# EAGLE schematic Main circuit (EAGLE 6.6.0)
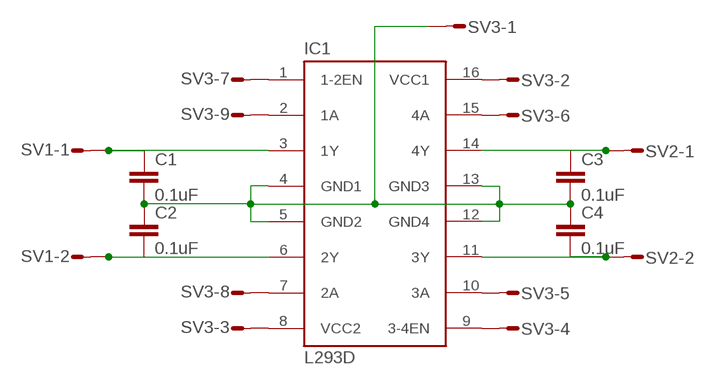
[diagram p0: schematic, sheet 1]

## Parts
C1  0.1uF  C2.5/2  [C2.5-2]
C2  0.1uF  C2.5/2  [C2.5-2]
C3  0.1uF  C2.5/2  [C2.5-2]
C4  0.1uF  C2.5/2  [C2.5-2]
IC1  L293D  [DIL16]
SV1  L02P  [L02P]
SV2  L02P  [L02P]
SV3  L09P  [L09P]

## Nets
N$1: C1.2 C2.1 C3.2 C4.1 IC1.4(GND1) IC1.5(GND2) IC1.12(GND4) IC1.13(GND3) SV3.1
N$2: IC1.7(2A) SV3.8
N$3: IC1.2(1A) SV3.9
N$4: IC1.1(1-2EN) SV3.7
N$5: C1.1 IC1.3(1Y) SV1.1
N$6: C2.2 IC1.6(2Y) SV1.2
N$7: C4.2 IC1.11(3Y) SV2.2
N$8: C3.1 IC1.14(4Y) SV2.1
N$9: IC1.15(4A) SV3.6
N$10: IC1.10(3A) SV3.5
N$11: IC1.9(3-4EN) SV3.4
N$12: IC1.8(VCC2) SV3.3
N$13: IC1.16(VCC1) SV3.2

## Library data of the parts
C1-C4 = capacitor-wima:C: CAPACITOR naming: grid - package width
IC1 = st-microelectronics:L293D: PUSH-PULL 4 CHANNEL DRIVER; MPN: L293D; OC_FARNELL: 9589619; OC_NEWARK: 56P8249
SV1 SV2 = con-amp-mt:L02P: AMP MT CONNECTOR; OC_FARNELL: unknown; OC_NEWARK: unknown
SV3 = con-amp-mt:L09P: AMP MT CONNECTOR; OC_FARNELL: unknown; OC_NEWARK: unknown